# Altium schematic sheet Schematic.SchDoc
size B; CompanyName: FERMI NATIONAL ACCELERATOR LABORATORY; Organization: UNITED STATES DEPARTMENT OF ENERGY; Address1: P.O. Box 500; Address2: MS222; Address3: Batavia, Illinois; Address4: USA 60510-0500; SheetNumber: 1; SheetTotal: 1; Application_Name: Altium NEXUS
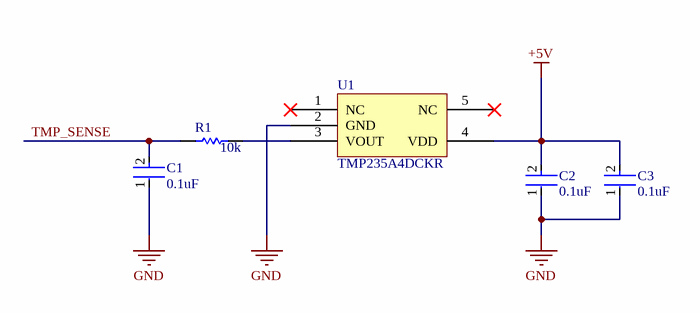
[diagram p0: Schematic.SchDoc]

## Parts
C1  Capacitance: 0.1uF  [CAPC1005X55N]  (hidden comment: TMK105BJ104KV-F)
C2  Capacitance: 0.1uF  [CAPC1005X55N]  (hidden comment: TMK105BJ104KV-F)
C3  0.1uF  [CAPC1005X55N]
R1  Resistance: 10k  [R0402]  (hidden comment: RC0402JR-0710KL)
U1  TMP235A4DCKR  [TMP]

## Nets
+5V: C2.2 C3.2 U1.4(VDD)
GND: C1.1 C2.1 C3.1 U1.2(GND)
TMP_SENSE: C1.2 R1.2
NetR1_1: R1.1 U1.3(VOUT)

Not connected (* = marked no-connect by the designer): U1 1(NC)* 5(NC)*

## Notes on the sheet
- REV
- DESCRIPTION
- DRAWN
- APPROVED
- DATE
- ORIGINATOR
- CHECKED
- USED ON:
- FERMI NATIONAL ACCELERATOR LABORATORY
- UNITED STATES DEPARTMENT OF ENERGY
- SOFTWARE
- DATE:
- DRAWING NUMBER
- SHEET
- of
- REVISION

## Library data of the parts
C1-C3 = TMK105BJ104KV-F: 0.1 µF ±10% 25V Ceramic Capacitor X5R 0402 (1005 Metric); MANUFAC.: Taiyo Yuden; VENDOR: Digikey; PARTNUM: TMK105BJ104KV-F
  C3: Capacitance: 0.1uF
R1 = RC0402JR-0710KL: 10 kOhms ±5% 0.063W, 1/16W Chip Resistor 0402 (1005 Metric) Moisture Resistant Thick Film; MANUFAC.: YAGEO; VENDOR: Digikey; PARTNUM: RC0402JR-0710KL
U1 = TMP235A4DCKR: Temperature Sensor Analog, Local -40°C ~ 150°C 10mV/°C SC-70-5; MANUFAC.: Texas Instruments; VENDOR: Digikey; PARTNUM: TMP235A4DCKR